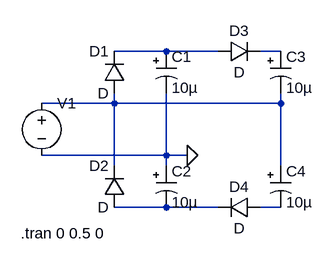
[diagram p0: schematic voltage_quadrupler_symetrical.asc]
voltage_quadrupler_symetrical.asc, the LTspice schematic file:
Version 4
SHEET 1 880 680
WIRE 304 48 224 48
WIRE 384 48 304 48
WIRE 480 48 448 48
WIRE 224 128 224 112
WIRE 224 128 112 128
WIRE 480 128 480 112
WIRE 480 128 224 128
WIRE 304 208 304 112
WIRE 304 208 112 208
WIRE 336 208 304 208
WIRE 224 224 224 128
WIRE 304 224 304 208
WIRE 480 224 480 128
WIRE 304 288 224 288
WIRE 384 288 304 288
WIRE 480 288 448 288
FLAG 336 208 0
SYMBOL voltage 112 112 R0
WINDOW 3 24 96 Invisible 2
WINDOW 123 0 0 Left 0
WINDOW 39 0 0 Left 0
SYMATTR Value SINE(0 155.56 60)
SYMATTR InstName V1
SYMBOL diode 240 112 R180
WINDOW 0 24 64 Left 2
WINDOW 3 24 0 Left 2
SYMATTR InstName D1
SYMBOL diode 240 288 R180
WINDOW 0 24 64 Left 2
WINDOW 3 24 0 Left 2
SYMATTR InstName D2
SYMBOL polcap 288 48 R0
SYMATTR InstName C1
SYMATTR Value 10µ
SYMBOL polcap 288 224 R0
SYMATTR InstName C2
SYMATTR Value 10µ
SYMBOL diode 384 64 R270
WINDOW 0 32 32 VTop 2
WINDOW 3 0 32 VBottom 2
SYMATTR InstName D3
SYMBOL diode 448 272 R90
WINDOW 0 0 32 VBottom 2
WINDOW 3 32 32 VTop 2
SYMATTR InstName D4
SYMBOL polcap 464 48 R0
SYMATTR InstName C3
SYMATTR Value 10µ
SYMBOL polcap 464 224 R0
SYMATTR InstName C4
SYMATTR Value 10µ
TEXT 80 328 Left 2 !.tran 0 0.5 0

The netlist it stands for:
* voltage_quadrupler_symetrical.asc
V1 N003 0 SINE(0 155.56 60)
D1 N003 N001 D
D2 N004 N003 D
C1 N001 0 10µ
C2 0 N004 10µ
D3 N001 N002 D
D4 N005 N004 D
C3 N002 N003 10µ
C4 N003 N005 10µ
.model D D
.lib standard.dio
.tran 0 0.5 0
.backanno
.end